# EAGLE design brakelight (EAGLE 9.5.2)
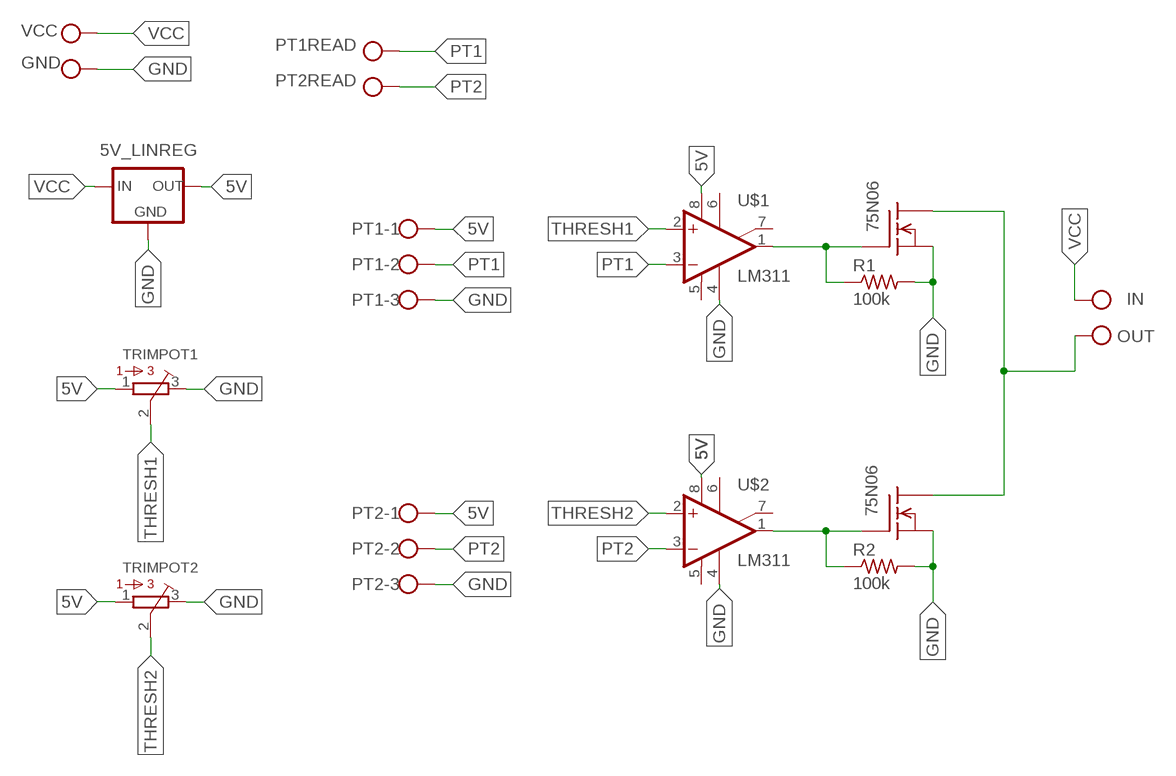
[diagram p0: schematic, sheet 1]

## Parts
5V_LINREG  78XXL  [78XXL]
BRAKELIGHT  W237-102  [W237-102]
INO_READ  W237-102  [W237-102]
LIPO_CONN  W237-102  [W237-102]
PT1  W237-103  [W237-103]
PT2  W237-103  [W237-103]
Q1  75N06  SUP75N06-08  [TO220]
Q2  75N06  SUP75N06-08  [TO220]
R1  100k  R-US_0204/7  [0204/7]
R2  100k  R-US_0204/7  [0204/7]
TRIMPOT1  3386-Y  [3386Y]
TRIMPOT2  3386-Y  [3386Y]
U$1  LM311  [DIL08]
U$2  LM311  [DIL08]

## Nets
5V: 5V_LINREG.OUT PT1.1 PT2.1 TRIMPOT1.1 TRIMPOT2.1 U$1.8(V+) U$2.8(V+)
GND: 5V_LINREG.GND LIPO_CONN.2 PT1.3 PT2.3 Q1.3(S) Q2.3(S) R1.2 R2.2 TRIMPOT1.3 TRIMPOT2.3 U$1.4(GND) U$2.4(GND)
N$1: Q1.1(G) R1.1 U$1.1(OUT)
N$2: Q2.1(G) R2.1 U$2.1(OUT)
N$3: BRAKELIGHT.2 Q1.2(D) Q2.2(D)
PT1: INO_READ.1 PT1.2 U$1.3(-IN)
PT2: INO_READ.2 PT2.2 U$2.3(-IN)
THRESH1: TRIMPOT1.2 U$1.2(+IN)
THRESH2: TRIMPOT2.2 U$2.2(+IN)
VCC: 5V_LINREG.IN BRAKELIGHT.1 LIPO_CONN.1
Unconnected: U$1.5(BAL) U$1.6(BAL/STRB) U$1.7(COL_OUT) U$2.5(BAL) U$2.6(BAL/STRB) U$2.7(COL_OUT)

## Library data of the parts
5V_LINREG = v-reg:78XXL: VOLTAGE REGULATOR
BRAKELIGHT INO_READ LIPO_CONN = con-wago-500:W237-102: WAGO SCREW CLAMP; MPN: 237-102; OC_FARNELL: unknown; OC_NEWARK: 70K9898
PT1 PT2 = con-wago-500:W237-103: WAGO SCREW CLAMP; MPN: 237-103; OC_FARNELL: unknown; OC_NEWARK: 18M7116
Q1 Q2 = transistor-fet:SUP75N06-08: N-Channel Enhancement MOSFET 60V; 75A; 0,008Ohm
R1 R2 = rcl:R-US_: RESISTOR, American symbol; SPICEPREFIX: R
TRIMPOT1 TRIMPOT2 = bourns:3386-: 3386 Series 3/8" Square Trimmer Potentiometer
U$1 U$2 = GTOR:LM311: LM311 Comparator

## Board
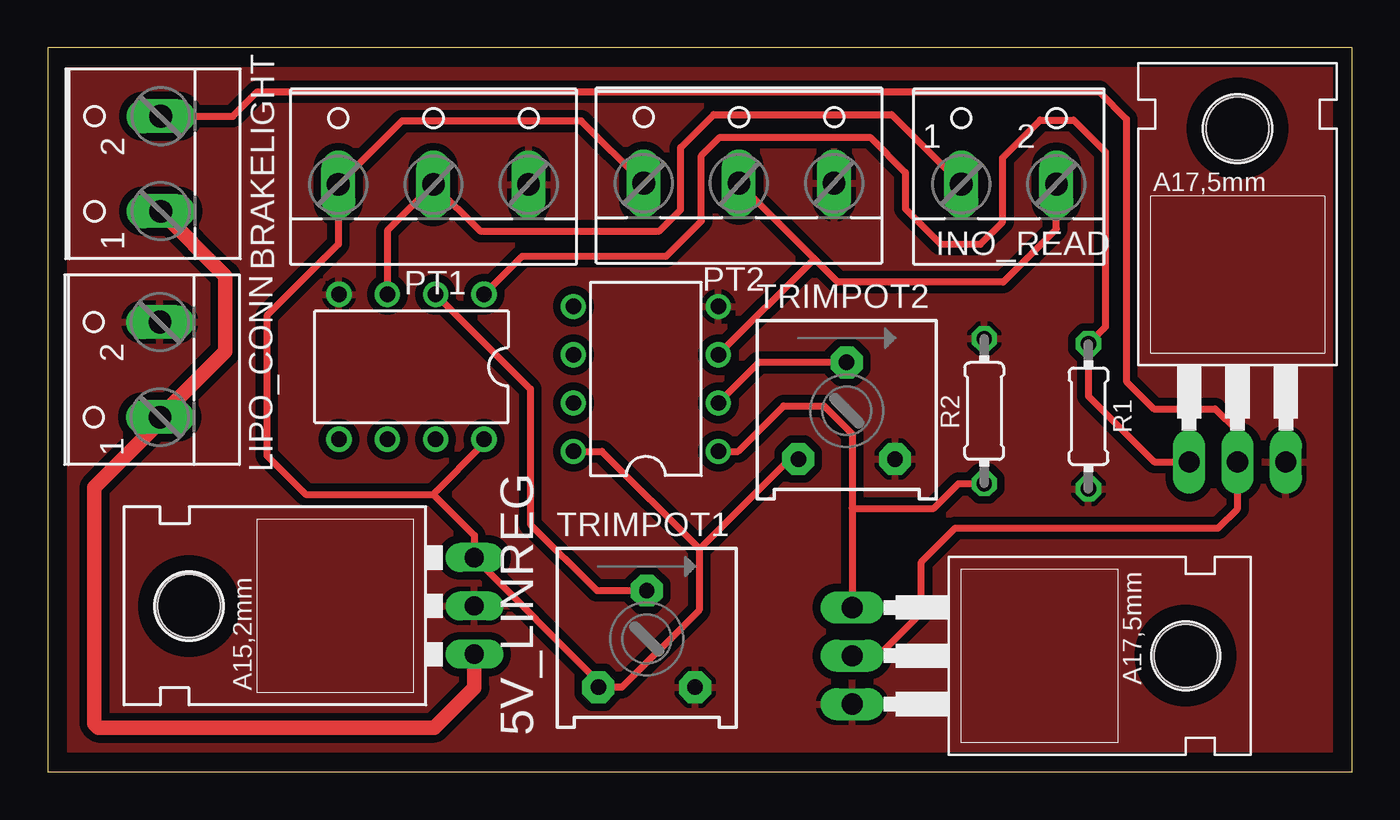
[diagram p1: board, top side]

Size 68.58 x 38.1 mm. Coordinates in mm from the lower left corner, seen from the top.
Outline: 0,0 68.58,0 68.58,38.1 0,38.1 0,0
Copper layers (1*16): Top 0.035mm / dielectric 1.5mm / Bottom 0.035mm
Design rules "default": minimum track width 6mil, minimum drill 0.35mm, track to track 6mil, track to pad 6mil, pad to pad 6mil, via to via 6mil, smd to smd 6mil, copper to edge 40mil, drill to drill 6mil, minimum pad ring 10mil, minimum via ring 8mil, stop-mask expansion 4mil, vias tented up to drill 0mil, thermal gap 10mil

### Footprints (pad centres in the part's own frame; a part is rotated, then mirrored left to right if it is on the bottom)
78XXL = drill 1.016 long: GND 0,-3.81; IN -2.54,-3.81; OUT 2.54,-3.81 | hole 3.302: 0,11.176
W237-102 = drill 1.194 long: 1 -2.5,-1.27; 2 2.5,-1.27
W237-103 = drill 1.194 long: 1 -5,-1.29; 2 0,-1.29; 3 5,-1.29
TO220 = drill 1.118 long: 1 -2.54,-6.35; 2 0,-6.35; 3 2.54,-6.35 | hole 3.302: 0,11.176
0204/7 = drill 0.813 octagon: 1 -3.81,0; 2 3.81,0
3386Y = drill 0.813 pad 1.676 octagon: 1 -2.54,-2.54; 2 0,2.54; 3 2.54,-2.54
DIL08 = drill 0.813 pad 1.27: 1 -3.81,-3.81; 2 -1.27,-3.81; 3 1.27,-3.81; 4 3.81,-3.81; 5 3.81,3.81; 6 1.27,3.81; 7 -1.27,3.81; 8 -3.81,3.81

### Placement (x,y rotation side)
5V_LINREG  18.62,8.73 90 top
BRAKELIGHT  4.68,31.99 90 top
INO_READ  50.52,32.18 0 top
LIPO_CONN  4.63,21.16 90 top
PT1  20.28,32.19 0 top
PT2  36.33,32.25 0 top
Q1  62.54,22.66 0 top
Q2  48.64,6.11 270 top
R1  54.71,18.71 270 top
R2  49.23,18.98 90 top
TRIMPOT1  31.49,7 0 top
TRIMPOT2  42,19 0 top
U$1  19.13,21.31 180 top
U$2  31.45,20.68 90 top

### Tracks (layer width: path | path; a pad name or v marks a point on that pad's centre or on a via)
5V
  Top 0.381: 20.27,14.61 13.56,14.61 11.53,16.64 11.53,24 15.28,27.75 PT1.1 18.62,34.24 28.06,34.24 PT2.1 | 20.27,14.61 22.43,12.45 5V_LINREG.OUT 28.95,4.75 TRIMPOT1.1 30.19,4.46 34.24,8.51 34.24,11.68 34.28,11.72 | 20.27,14.61 22.94,17.27 U$1.8 | 34.28,11.72 29.13,16.87 U$2.8 | 34.28,11.72 39.02,16.46 TRIMPOT2.1
GND
  pour Top (isolate 0.406): 0.1,38.07 0.1,0 68.58,0 68.58,38.07 0.1,38.07
N$1
  Top 0.381: Q1.1 58.16,16.31 54.71,19.77 R1.1 55.6,23.41 55.6,32.61 53.92,34.29 52.17,34.29 50.19,32.31 50.19,28.93 49.02,27.76 46.94,27.76 45.09,29.62 45.09,31.52 43.23,33.38 35.33,33.38 34.37,32.41 34.37,28.98 32.51,27.13 24.94,27.13 U$1.1
N$2
  Top 0.381: U$2.1 36.3,16.87 38.68,19.25 40.82,19.25 42.29,17.78 42.29,13.87 | 42.29,13.87 Q2.1 | 42.29,13.87 46.58,13.87 47.89,15.17 R2.1
N$3
  Top 0.381: BRAKELIGHT.2 9.73,34.49 11.01,35.77 55.27,35.77 56.69,34.34 56.69,20.55 58.14,19.1 61.37,19.1 62.54,17.93 Q1.2 62.54,13.85 61.52,12.83 47.7,12.83 45.92,11.05 45.92,8.38 43.65,6.11 Q2.2
PT1
  Top 0.381: INO_READ.1 44.36,34.57 35,34.57 33.27,32.84 33.27,29.57 32.16,28.45 22.73,28.45 PT1.2 17.86,28.48 U$1.3
PT2
  Top 0.381: PT2.2 40.29,27.01 | 40.29,27.01 41.54,25.76 50.22,25.76 53.02,28.56 INO_READ.2 | U$2.3 40.29,26.98 40.29,27.01
THRESH1
  Top 0.381: U$1.2 25.38,20.14 25.38,13.03 28.86,9.54 TRIMPOT1.2
THRESH2
  Top 0.381: TRIMPOT2.2 37.39,21.54 U$2.2
VCC
  Top 0.762: BRAKELIGHT.1 9.35,26.09 9.35,22.1 LIPO_CONN.1 5.91,18.41 2.46,14.96 2.46,2.54 2.67,2.33 20.33,2.33 22.43,4.43 5V_LINREG.IN